# Altium project Duckuinp.PrjPcb
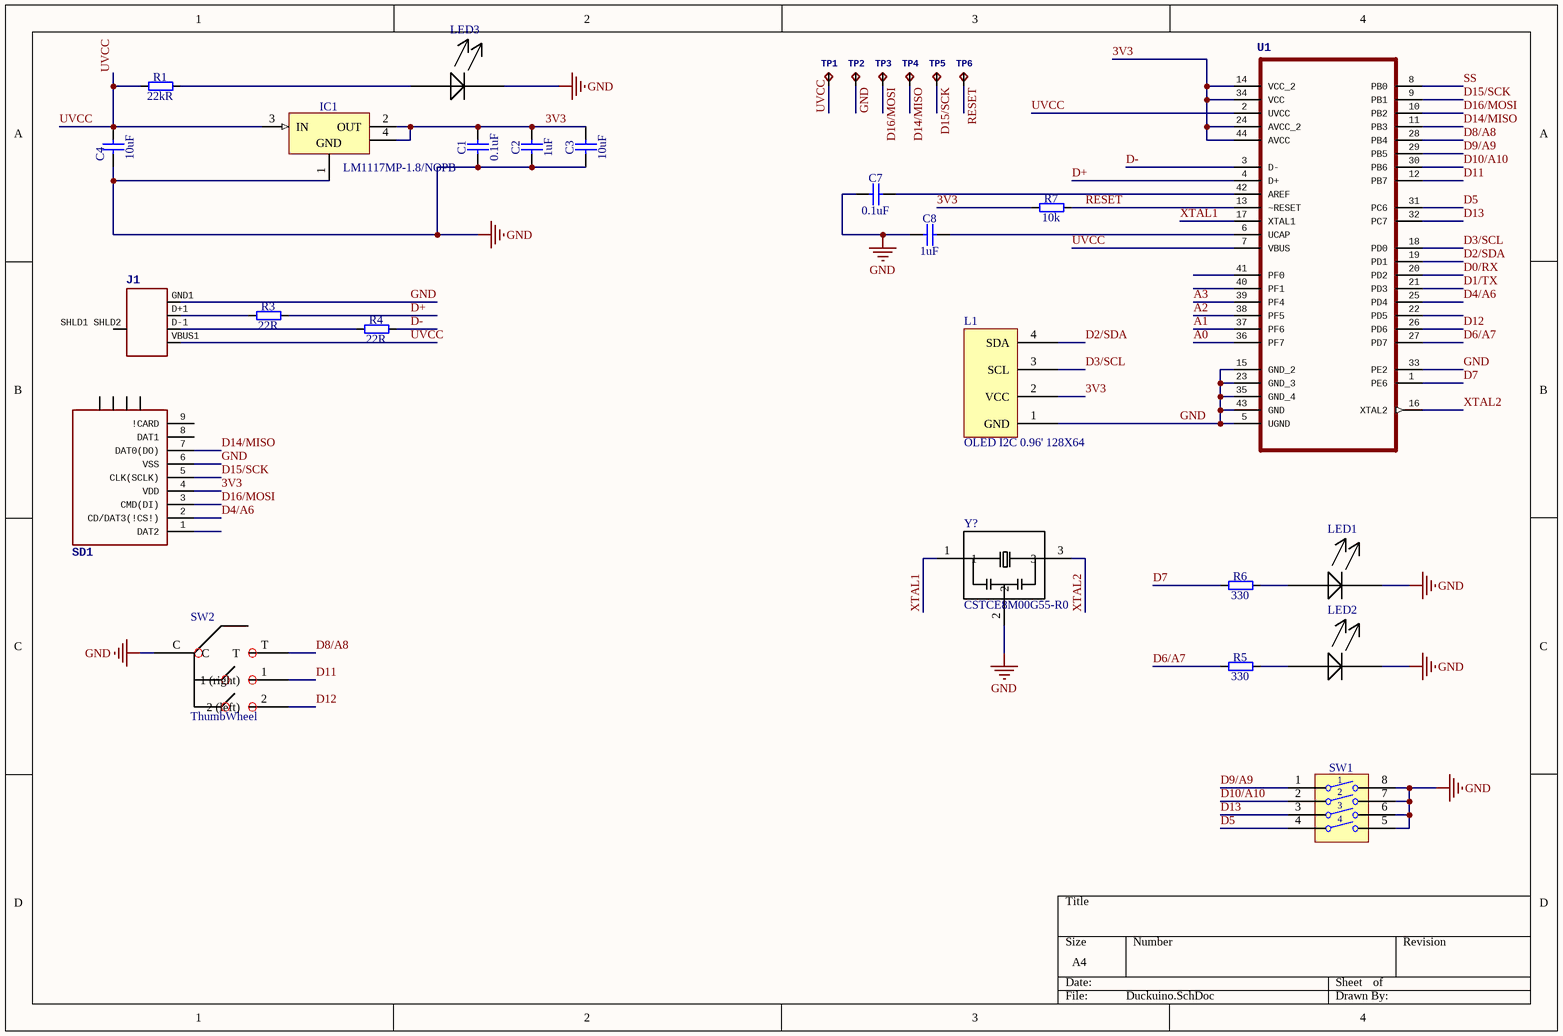
[diagram p0: Duckuino.SchDoc]
1 sheet, 29 parts. Net scope: global (net labels, ports and power ports of the same name join across sheets).
Board file: Duckuino.PcbDoc

## Sheet Duckuino.SchDoc
size A4

### Parts
C1  0.1uF  [CAPC1608X87N]
C2  1uF  [CAPC1608X87N]
C3  10uF  [CAPC1608X87N]
C4  10uF  [CAPC1608X87N]
C7  0.1uF  [CAPC1608X87N]
C8  1uF  [CAPC1608X87N]
IC1  LM1117MP-1.8/NOPB  [SOT230P700X180-4N]
J1  (no value)  [USB-A-SMT-MALE]
L1  OLED I2C 0.96' 128X64  [OLED I2C 0.91]
LED1  (no value)  [LED 0603]
LED2  (no value)  [LED 0603]
LED3  (no value)  [LED 0603]
R1  22kR  [RESC1608X55N]
R3  22R  [RESC1608X55N]
R4  22R  [RESC1608X55N]
R5  330  [RESC1608X55N]
R6  330  [RESC1608X55N]
R7  10k  [RESC1608X55N]
SD1  (no value)  [TF-PULL]
SW1  Switch  [SW_CTS_219-4MST]  (value not drawn)
SW2  ThumbWheel  [ThumbWheel]
TP1  Test pad  [TP20SQ]  (value not drawn)
TP2  Test pad  [TP20SQ]  (value not drawn)
TP3  Test pad  [TP20SQ]  (value not drawn)
TP4  Test pad  [TP20SQ]  (value not drawn)
TP5  Test pad  [TP20SQ]  (value not drawn)
TP6  Test pad  [TP20SQ]  (value not drawn)
U1  (no value)  [QFP80P1200X1200X120-44N]
Y?  CSTCE8M00G55-R0  [OSC_CSTCE8M00G55-R0]

### Nets
GND: C1.1 C2.1 C3.1 C4.1 C7.1 C8.1 IC1.1(GND) J1.GND1(GND) L1.1(GND) LED1.2(-) LED2.2(-) LED3.2(-) SD1.6(VSS) SW1.5 SW1.6 SW1.7 SW1.8 SW2.C TP2.TP U1.5(UGND) U1.15(GND_2) U1.23(GND_3) U1.33(PE2) U1.35(GND_4) U1.43(GND) Y?.2
3V3: C1.2 C2.2 C3.2 IC1.2(OUT) IC1.4(OUT) L1.2(VCC) R7.1 SD1.4(VDD) U1.14(VCC_2) U1.24(AVCC_2) U1.34(VCC) U1.44(AVCC)
A0: U1.36(PF7)
A1: U1.37(PF6)
A2: U1.38(PF5)
A3: U1.39(PF4)
D0/RX: U1.20(PD2)
D1/TX: U1.21(PD3)
D2/SDA: L1.4(SDA) U1.19(PD1)
D3/SCL: L1.3(SCL) U1.18(PD0)
D4/A6: SD1.2(CD/DAT3(!CS!)) U1.25(PD4)
D5: SW1.4 U1.31(PC6)
D6/A7: R5.1 U1.27(PD7)
D7: R6.1 U1.1(PE6)
D8/A8: SW2.T U1.28(PB4)
D9/A9: SW1.1 U1.29(PB5)
D10/A10: SW1.2 U1.30(PB6)
D11: SW2.1(1_(right)) U1.12(PB7)
D12: SW2.2(2_(left)) U1.26(PD6)
D13: SW1.3 U1.32(PC7)
D14/MISO: SD1.7(DAT0(DO)) TP4.TP U1.11(PB3)
D15/SCK: SD1.5(CLK(SCLK)) TP5.TP U1.9(PB1)
D16/MOSI: SD1.3(CMD(DI)) TP3.TP U1.10(PB2)
D+: R3.2 U1.4(D+)
D-: R4.2 U1.3(D-)
RESET: R7.2 TP6.TP U1.13(~RESET)
SS: U1.8(PB0)
UVCC: C4.2 IC1.3(IN) J1.VBUS1(VBUS) R1.1 TP1.TP U1.2(UVCC) U1.7(VBUS)
XTAL1: U1.17(XTAL1) Y?.1
XTAL2: U1.16(XTAL2) Y?.3
NetC7_2: C7.2 U1.42(AREF)
NetC8_2: C8.2 U1.6(UCAP)
NetJ1_D+1: J1.D+1(D+) R3.1
NetJ1_D-1: J1.D-1(D-) R4.1
NetLED1_1: LED1.1(+) R6.2
NetLED2_1: LED2.1(+) R5.2
NetLED3_1: LED3.1(+) R1.2

Not connected (* = marked no-connect by the designer): J1 SHLD1 SHLD2(SHIELD); SD1 1(DAT2) 8(DAT1) 9(!CARD) S1 S2 S3 S4; U1 22(PD5) 40(PF1) 41(PF0)

### Library data of the parts
C1-C4 C7 C8 = CC0603_12NF_50V_10%_X7R: Non-polarised capacitor; Part Description: SMD Multilayer Chip Ceramic Capacitor; Manufacturer: GENERIC; Manufacturer1 Part Number: 223858615637; Value: 12nF; Voltage: 50V; TC: X7R; Tolerance: ±10%; Part Number: CC0603_12NF_50V_10%_X7R; Component Kind: Standard; Component Type: Standard; Pin Count: 2; Status: Preferred; Manufacturer Part Number: CC0603_12NF_50V_10%_X7R; Case: 0603; Mounted: Yes; Socket: No; SMD: Yes; Sense: No; Manufacturer1 Example: PHYCOMP; Manufacturer1 ComponentHeight: 0.87mm; HelpURL: \\cern.ch\dfs\Applications\Altium\Datasheets\CC0603_X7R_PHYCOMP.pdf; Author: CERN DEM JLC; CreateDate: 03/12/2007; LatestRevisionDate: 03/12/2007
IC1 = LM1117MP-1.8/NOPB: 3-Terminal Regulator 1=GND 2=OUT 3=IN 4=OUT; Part Description: 1.8V 800mA Low-Dropout Linear Regulator; Manufacturer: TEXAS INSTRUMENTS; PressFit: No; Bonding: No; Part Number: LM1117MP-1.8/NOPB; Component Kind: Standard; Component Type: Standard; Device: LM1117MP-1.8/NOPB; PackageDescription: SOT223, 2.30mm pitch; 3 pin, 3.70mm W X 6.70mm L, IPC Medium Density; Manufacturer Part Number: LM1117MP-1.8/NOPB; Pin Count: 4; Case: SOT223; Mounted: Yes; Socket: No; SMD: Yes; Sense: No; ComponentHeight: 1.8mm; HelpURL: \\cern.ch\dfs\Applications\Altium\Datasheets\LM1117MP-1.8-NOPB.pdf; Author: CERN DEM JLC; CreateDate: 18/01/2011; LatestRevisionDate: 16/09/2014
J1 = USB_A_SMT_MALE: PROD_ID: CONN-11499
LED1-LED3 = LED
R1 R3-R7 = R0603_0R_JUMPER: Resistor; Part Description: 1A (0.05R Max DC Resistance) Zero Ohm Jumper; Manufacturer: GENERIC; Manufacturer1 Part Number: NRC06Z0; Value: 0; PressFit: No; Part Number: R0603_0R_JUMPER; Component Kind: Standard; Component Type: Standard; Pin Count: 2; Status: Preferred; Manufacturer Part Number: R0603_0R_JUMPER; Case: 0603; Mounted: Yes; Sense: No; Socket: No; SMD: Yes; Manufacturer1 Example: NIC COMPONENT; Manufacturer1 ComponentHeight: 0.55mm; HelpURL: \\cern.ch\dfs\Applications\Altium\Datasheets\R0603_NIC_NRC.pdf; Author: CERN DEM JLC; CreateDate: 03/12/2007; LatestRevisionDate: 13/03/2008
SD1 = TF-HOLDER
SW1 = SW_CTS_219-4MST: 4 Ways SPST DIP Switch; Part Description: 4 Ways, Pitch 2.54mm, SPST DIP Switch, Rating 100mA 50VDC; Manufacturer: CTS ELECTROCOMPONENTS; PressFit: No; Part Number: SW_CTS_219-4MST; Component Kind: Standard; Component Type: Standard; Pin Count: 8; PackageDescription: Pitch 2.54mm, Body 6.7 x 11.63mm, 4 Ways SPST Surface-Mounting DIP Switch, CTS 219 Series; Family: Switch; Mounted: Yes; Socket: No; SMD: Yes; Sense: No; Status: None; Manufacturer Part Number: 219-4MST; ComponentHeight: 2.23mm; HelpURL: \\cern.ch\dfs\Applications\Altium\Datasheets\SW_CTS_219-4MST.pdf; Author: CERN DEM JLC; CreateDate: 17/11/2014; LatestRevisionDate: 17/11/2014
TP1-TP6 = TPTP20SQ
U1 = ATMEGA32U4-AU: MPN: ATMEGA32U4-AU; OC_FARNELL: 1748525; OC_NEWARK: 26R5633; PACKAGE: TQFP-44; SUPPLIER: Atmel
Y? = CSTCE8M00G55-R0: Ceramic Resonator 8MHz ??0.5% _Tol_ ??0.2% _Stability_ 33pF 40Ohm 3-Pin CSMD T/R; MF: Murata; SnapEDA_Link: https://www.snapeda.com/parts/CSTCE8M00G55-R0/Murata%20Electronics%20North%20America/view-part/?ref=snap; Availability: Good; MP: CSTCE8M00G55-R0; Price: 0.27 USD; Package: SMD-3 Murata; Value: *